# EAGLE design PCB_Agrosavia (EAGLE 9.6.2)
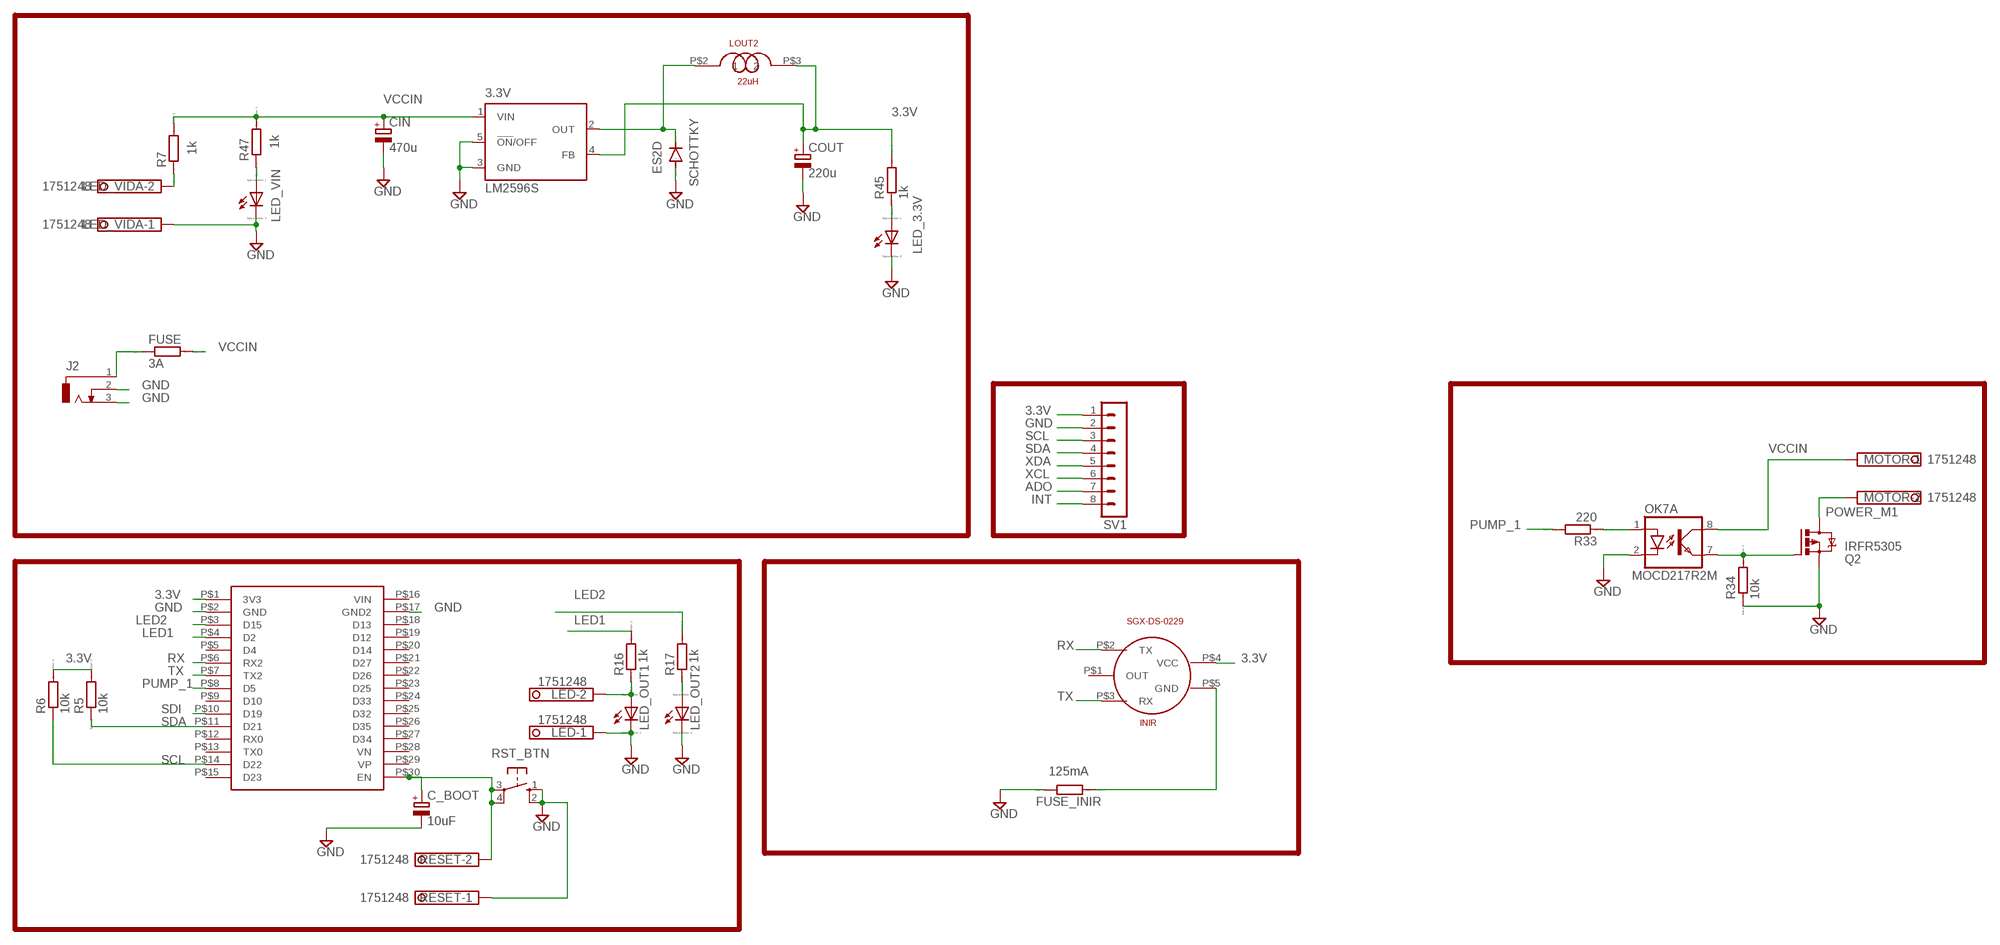
[diagram p0: schematic, sheet 1]

## Parts
3.3V  LM2596S  [TO263-5]
C_BOOT  10uF  CPOL-EUSANYO_SMD_B6  [SANYO-OSCON_SMD_B6]
CIN  470u  CPOL-EUSANYO_SMD_F12  [SANYO-OSCON_SMD_F12]
COUT  220u  CPOL-EUUD-10X10  [UD-10X10_NICHICON]
ESP32DEVKITV1  ESP32  [ESP32]
FUSE  3A  RR1206  [R1206]
FUSE_INIR  125mA  RR0402  [R0402]
J2  DCJ0303  [DCJ0303]
LED  1751248  [1751248]
LED_3.3V  LED_E  [LED_1206]
LED_OUT1  LED_E  [LED_1206]
LED_OUT2  LED_E  [LED_1206]
LED_VIDA  1751248  [1751248]
LED_VIN  LED_E  [LED_1206]
LOUT2  22uH  SRP1038A  [SRP1038A]
MOTOR  1751248  [1751248]
OK7  MOCD217R2M  ILD205  [SOIC08]
Q2  IRFR5305  [D-PAK_TO252AA]
R5  10k  RR1206  [R1206]
R6  10k  RR1206  [R1206]
R7  1k  R  [R0805]
R16  1k  R  [R0805]
R17  1k  R  [R0805]
R33  220  RR0603  [R0603]
R34  10k  RR1206  [R1206]
R45  1k  R  [R0805]
R47  1k  R  [R0805]
RESET  1751248  [1751248]
RST_BTN  10-XX  [B3F-10XX]
SCHOTTKY  ES2D  [SMB]
SGX-DS-0229  INIR  [INIR]
SV1  MA08-1  [MA08-1]

## Nets
3.3V: 3.3V.4(FB) COUT.+ ESP32DEVKITV1.P$1(3V3) LOUT2.P$3 R5.2 R6.2 R45.2 SGX-DS-0229.P$4(VCC) SV1.1
ADO: SV1.7
GND: 3.3V.3(GND) 3.3V.5(!ON!/OFF) C_BOOT.- CIN.- COUT.- ESP32DEVKITV1.P$2(GND) ESP32DEVKITV1.P$17(GND2) FUSE_INIR.2 J2.2 J2.3 LED.1 LED_3.3V.C LED_OUT1.C LED_OUT2.C LED_VIDA.1 LED_VIN.C OK7.2(A:C) Q2.3(S) R34.1 RESET.1 RST_BTN.1(S) RST_BTN.2(S1) SCHOTTKY.A SV1.2
INT: SV1.8
LED1: ESP32DEVKITV1.P$4(D2) R16.2
LED2: ESP32DEVKITV1.P$3(D15) R17.2
N$6: FUSE_INIR.1 SGX-DS-0229.P$5(GND)
N$7: C_BOOT.+ ESP32DEVKITV1.P$30(EN) RESET.2 RST_BTN.3(P) RST_BTN.4(P1)
N$9: LED_VIDA.2 R7.1
N$15: LED.2 LED_OUT1.A R16.1
N$16: LED_OUT2.A R17.1
N$33: OK7.1(A:A) R33.1
N$37: OK7.7(A:EMIT) Q2.1(G) R34.2
N$43: 3.3V.2(OUT) LOUT2.P$2 SCHOTTKY.C
N$48: LED_3.3V.A R45.1
N$49: LED_VIN.A R47.1
N$63: FUSE.1 J2.1
POWER_M1: MOTOR.2 Q2.4(D)
PUMP_1: ESP32DEVKITV1.P$8(D5) R33.2
RX: ESP32DEVKITV1.P$6(RX2) SGX-DS-0229.P$2(TX)
SCL: ESP32DEVKITV1.P$14(D22) R6.1 SV1.3
SDA: ESP32DEVKITV1.P$11(D21) R5.1 SV1.4
SDI: ESP32DEVKITV1.P$10(D19)
TX: ESP32DEVKITV1.P$7(TX2) SGX-DS-0229.P$3(RX)
VCCIN: 3.3V.1(VIN) CIN.+ FUSE.2 MOTOR.1 OK7.8(A:COL) R7.2 R47.2
XCL: SV1.6
XDA: SV1.5
Unconnected: ESP32DEVKITV1.P$5(D4) ESP32DEVKITV1.P$9(D10) ESP32DEVKITV1.P$12(RX0) ESP32DEVKITV1.P$13(TX0) ESP32DEVKITV1.P$15(D23) ESP32DEVKITV1.P$16(VIN) ESP32DEVKITV1.P$18(D13) ESP32DEVKITV1.P$19(D12) ESP32DEVKITV1.P$20(D14) ESP32DEVKITV1.P$21(D27) ESP32DEVKITV1.P$22(D26) ESP32DEVKITV1.P$23(D25) ESP32DEVKITV1.P$24(D33) ESP32DEVKITV1.P$25(D32) ESP32DEVKITV1.P$26(D35) ESP32DEVKITV1.P$27(D34) ESP32DEVKITV1.P$28(VN) ESP32DEVKITV1.P$29(VP) OK7.3(B:A) OK7.4(B:C) OK7.5(B:EMIT) OK7.6(B:COL) SGX-DS-0229.P$1(OUT)

## Library data of the parts
3.3V = national-semiconductor:LM2596: SIMPLE SWITCHER® Power Converter 150 kHz 3A Step-Down Voltage Regulator Source: http://www.national.com/ds/LM/LM2596.pdf; MF: NATIONAL SEMICONDUCTOR; MPN: LM2596S-ADJ/NOPB; OC_FARNELL: 9494367; OC_NEWARK: 41K3842
C_BOOT CIN COUT = rcl:CPOL-EU: POLARIZED CAPACITOR, European symbol; SPICEPREFIX: C
ESP32DEVKITV1 = ESP32:ESP32
FUSE FUSE_INIR R5-R7 R16 R17 R33 R34 R45 R47 = eagle-ltspice:R: RESISTOR, European symbol; SPICEMODEL: NONE; SPICEPREFIX: R
J2 = con-jack:DCJ0303: DC POWER JACK Source: DCJ0303.pdf; OC_FARNELL: unknown; OC_NEWARK: unknown
LED LED_VIDA MOTOR RESET = con-phoenix-350:1751248: MKDS 1/ 2-3,5 Printklemme Nennstrom: 10 A Bemessungsspannung: 160 V Raster: 3,5 mm Polzahl: 2 Montageart: Löten Anschlussart: Schraubanschluss Anschlussrichtung vom Leiter zur Platine: 0° Source: http://eshop.phoenixcontact.com .. 1751248.pdf; OC_FARNELL: unknown; OC_NEWARK: unknown
LED_3.3V LED_OUT1 LED_OUT2 LED_VIN = eagle-ltspice:LED_E: LED Source: http://www.osram.convergy.de Source: www.luxeon.com Source: www.kingbright.com; SPICEMODEL: NONE; SPICEPREFIX: D; SPICETYPE: diode
LOUT2 = SRP1038A:SRP1038A
OK7 = optocoupler:ILD2*: Siemens ILD205/206/207/211/213/217 DUAL PHOTOTRANSISTOR SMALL OUTLINE SURFACE MOUNT OPTOCOUPLER Source: 153385-da-01-en-Optocoupler_ILD205-T.pdf; MF: VISHAY/TELEFUNKEN; MPN: ILD205T; OC_FARNELL: 1469512; OC_NEWARK: 20H8678
Q2 = transistor-power:IRF?5305: HEXFET Power MOSFET Source: http://www.irf.com/product-info/datasheets/data/irfr5305pbf.pdf
RST_BTN = switch-omron:10-XX: OMRON SWITCH; MPN: B3F-1000; OC_FARNELL: 176432; OC_NEWARK: 36M3542
SCHOTTKY = diode:ES2D: DIODE super fast rectifier, 2 A
SGX-DS-0229 = INIR:INIR
SV1 = con-lstb:MA08-1: PIN HEADER; OC_FARNELL: unknown; OC_NEWARK: unknown

## Board
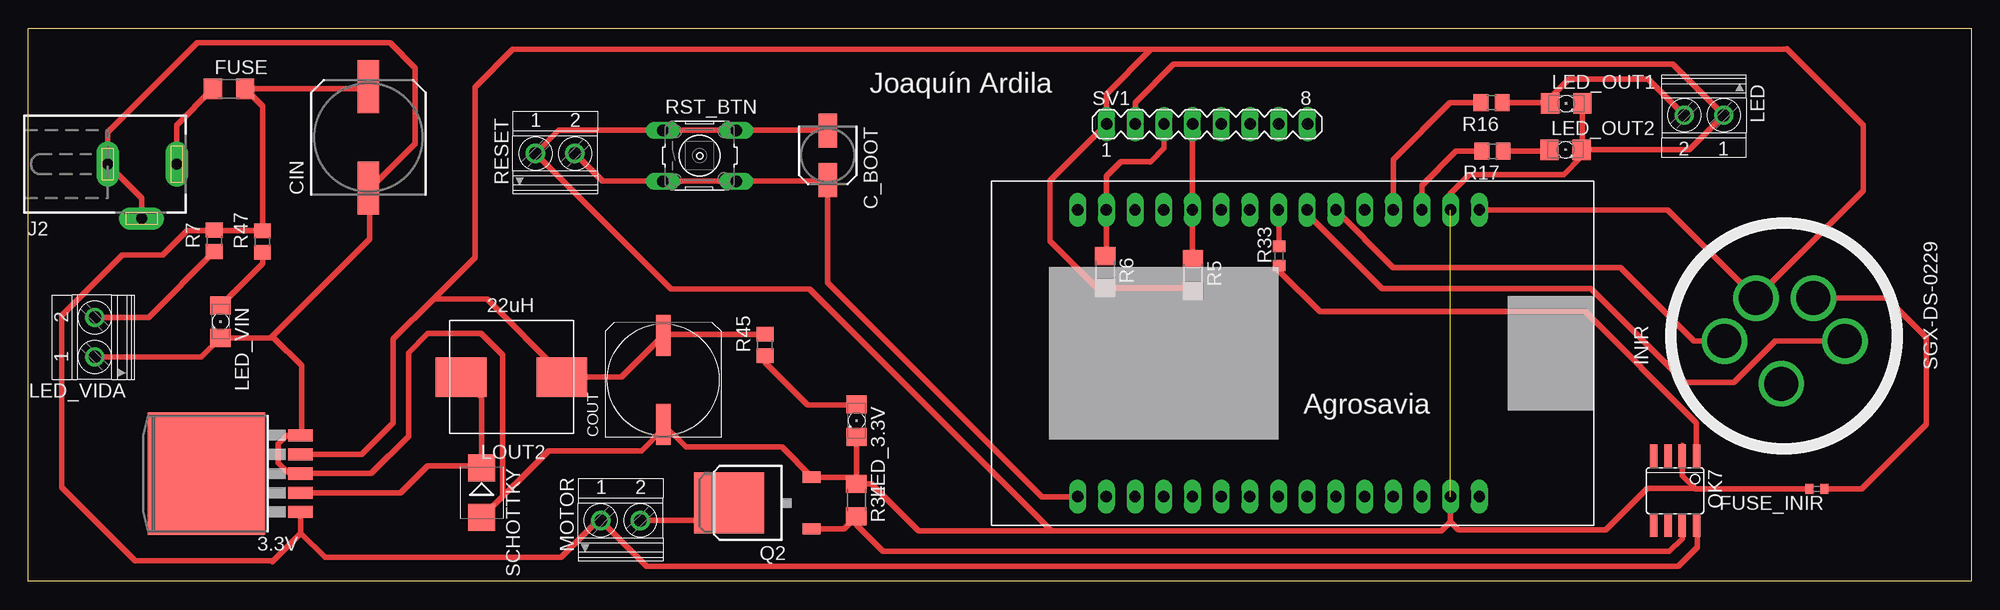
[diagram p1: board, top side]

Size 172 x 49 mm. Coordinates in mm from the lower left corner, seen from the top.
Outline: 0,49 172,49 172,0 0,0 0,49
Copper layers (1*16): Top 0.035mm / dielectric 1.5mm / Bottom 0.035mm
Design rules "default": minimum track width 6mil, minimum drill 0.35mm, track to track 6mil, track to pad 6mil, pad to pad 6mil, via to via 6mil, smd to smd 6mil, copper to edge 40mil, drill to drill 6mil, minimum pad ring 10mil, minimum via ring 8mil, stop-mask expansion 4mil, vias tented up to drill 0mil, thermal gap 10mil

### Footprints (pad centres in the part's own frame; a part is rotated, then mirrored left to right if it is on the bottom)
TO263-5 = smd 1.067 x 2.159: 1 -3.404,-5.791; 2 -1.702,-5.791; 3 0,-5.791; 4 1.702,-5.791; 5 3.404,-5.791 | smd 10.8 x 10.41: 6 0,2.54
SANYO-OSCON_SMD_B6 = smd 3 x 1.6: + 2.2,0; - -2.2,0
SANYO-OSCON_SMD_F12 = smd 4.7 x 1.9: + 4.5,0; - -4.5,0
UD-10X10_NICHICON = smd 3.6 x 1.3: + 3.925,0; - -3.95,0
ESP32 = drill 1 long: P$1 -12.7,15.24; P$2 -12.7,12.7; P$3 -12.7,10.16; P$4 -12.7,7.62; P$5 -12.7,5.08; P$6 -12.7,2.54; P$7 -12.7,0; P$8 -12.7,-2.54; P$9 -12.7,-5.08; P$10 -12.7,-7.62; P$11 -12.7,-10.16; P$12 -12.7,-12.7; P$13 -12.7,-15.24; P$14 -12.7,-17.78; P$15 -12.7,-20.32; P$16 12.7,15.24; P$17 12.7,12.7; P$18 12.7,10.16; P$19 12.7,7.62; P$20 12.7,5.08; P$21 12.7,2.54; P$22 12.7,0; P$23 12.7,-2.54; P$24 12.7,-5.08; P$25 12.7,-7.62; P$26 12.7,-10.16; P$27 12.7,-12.7; P$28 12.7,-15.24; P$29 12.7,-17.78; P$30 12.7,-20.32
R1206 = smd 1.6 x 1.803: 1 -1.422,0; 2 1.422,0
R0402 = smd 0.7 x 0.9: 1 -0.65,0; 2 0.65,0
DCJ0303 = drill 1 pad 2 long: 1 0,3.1; 2 4.8,0; 3 0,-3
1751248 = drill 1.1 pad 1.7: 1 -1.75,-0.1; 2 1.75,-0.1
LED_1206 = smd 1.6 x 1.803: A -1.422,0; C 1.422,0
SRP1038A = smd 4.5 x 3.5: P$2 4.45,0; P$3 -4.45,0
SOIC08 = smd 0.66 x 2.032: 1 -1.905,-3.073; 2 -0.635,-3.073; 3 0.635,-3.073; 4 1.905,-3.073; 5 1.905,3.073; 6 0.635,3.073; 7 -0.635,3.073; 8 -1.905,3.073
D-PAK_TO252AA = smd 1 x 1.6: 1 -2.28,-4.8; 3 2.28,-4.8 | smd 5.4 x 6.2: 4 0,2.5
R0805 = smd 1.3 x 1.5: 1 -0.95,0; 2 0.95,0
R0603 = smd 1 x 1.1: 1 -0.85,0; 2 0.85,0
B3F-10XX = drill 1.016 long: 1 -3.251,2.261; 2 3.251,2.261; 3 -3.251,-2.261; 4 3.251,-2.261
SMB = smd 2.4 x 2.4: A 2.2,0; C -2.2,0
INIR = drill 3 pad 4: P$1 4.24,0.254; P$2 0.46,5.289; P$3 0.46,-5.381; P$4 -3.34,2.494; P$5 -3.34,-2.586
MA08-1 = drill 1.016 long: 1 -8.89,0; 2 -6.35,0; 3 -3.81,0; 4 -1.27,0; 5 1.27,0; 6 3.81,0; 7 6.35,0; 8 8.89,0

### Placement (x,y rotation side)
3.3V  18.3,9.55 90 top
C_BOOT  70.78,37.74 270 top
CIN  30.11,39.33 90 top
COUT  56.21,17.86 90 top
ESP32DEVKITV1  113.21,20.21 270 top
FUSE  17.77,43.63 0 top
FUSE_INIR  158.32,8.21 180 top
J2  10.04,36.96 270 top
LED  148.34,41.19 180 top
LED_3.3V  73.32,14.24 270 top
LED_OUT1  136.14,42.33 0 top
LED_OUT2  136.08,38.24 0 top
LED_VIDA  5.79,21.64 90 top
LED_VIN  17.02,23.01 270 top
LOUT2  42.79,18.09 180 top
MOTOR  52.43,5.5 0 top
OK7  145.78,8.04 180 top
Q2  64.53,6.95 90 top
R5  103.1,27.14 270 top
R6  95.33,27.4 270 top
R7  16.48,30.17 90 top
R16  129.53,42.41 180 top
R17  129.62,38.1 180 top
R33  110.72,28.83 90 top
R34  73.32,7.21 270 top
R45  65.21,20.94 90 top
R47  20.73,30.11 90 top
RESET  46.65,38.01 0 top
RST_BTN  59.43,37.71 0 top
SCHOTTKY  40.13,7.87 270 top
SGX-DS-0229  155.44,21.75 270 bottom
SV1  104.35,40.51 0 top

### Tracks (layer width: path | path; a pad name or v marks a point on that pad's centre or on a via)
3.3V
  Top 0.5: 3.3V.4 29.52,11.25 32.32,14.05 32.32,21.46 35.87,25.01 | 35.87,25.01 40.61,25.01 47.24,18.38 LOUT2.P$3 52.52,18.09 COUT.+ 56.31,21.89 R45.2 65.29,21.97 | 155.73,47.13 162.46,40.39 162.46,34.61 SGX-DS-0229.P$4 145.12,32.91 ESP32DEVKITV1.P$1 | 155.73,47.13 155.66,47.19 | R5.2 102.85,25.98 R6.2 94.62,25.98 90.46,30.14 90.46,35.51 SV1.1 95.46,43.18 99.41,47.13 | 155.73,47.13 99.41,47.13 | 99.41,47.13 42.88,47.13 39.55,43.8 39.55,28.69 35.87,25.01
GND  (1 unrouted)
  Top 0.5: C_BOOT.- 70.74,39.97 RST_BTN.2 RST_BTN.1 46.96,39.97 RESET.1 56.9,25.91 69.16,25.91 90.6,4.47 | 73.17,8.48 R34.1 | J2.2 10.04,33.96 J2.3 7.04,39.77 14.96,47.7 32.02,47.7 34.26,45.46 34.26,38.8 30.29,34.83 CIN.- 30.21,34.73 30.21,30.34 21.45,21.58 LED_VIN.C | LED_VIDA.1 15.32,19.89 LED_VIN.C | Q2.3 69.39,9.23 | 69.39,9.23 72.72,9.23 R34.1 | 69.39,9.23 66.72,11.9 58.22,11.9 COUT.- 56.21,13.52 54.27,11.58 46.05,11.58 SCHOTTKY.A 42,7.54 42,20.06 40.1,21.96 35.36,21.96 33.65,20.25 33.65,12.85 30.36,9.55 3.3V.3 23.08,9.55 22.14,10.49 22.14,12.17 22.92,12.96 3.3V.5 24.2,13.06 24.2,19.12 21.73,21.58 LED_VIN.C | LED_OUT1.C 137.56,38.29 LED_OUT2.C | ESP32DEVKITV1.P$2 125.91,34.37 127.58,36.04 135.92,36.04 137.51,37.62 LED_OUT2.C | LED_OUT2.C 147.04,38.24 LED.1 145.57,45.81 101.39,45.81 98,42.42 SV1.2 | LED_3.3V.C R34.1 | 146.41,12.06 OK7.2 146.41,9.37 147.55,8.23 | FUSE_INIR.2 147.58,8.21 147.55,8.23 | 147.55,8.23 143.34,8.23 139.67,4.57 126.61,4.57 125.91,5.26 125.91,5.27 | ESP32DEVKITV1.P$17 125.91,5.27 | R34.1 74.67,8.63 78.83,4.47 90.6,4.47 | 90.6,4.47 125.11,4.47 125.91,5.27
LED1
  Top 0.5: ESP32DEVKITV1.P$4 120.83,37.37 125.87,42.41 R16.2
LED2
  Top 0.5: ESP32DEVKITV1.P$3 123.37,35.08 126.39,38.1 R17.2
N$6
  Top 0.5: SGX-DS-0229.P$5 164.51,25.09 168,21.59 | 168,21.59 168.03,21.57 | 168,21.59 168,13.92 162.29,8.21 FUSE_INIR.1
N$7
  Top 0.5: RESET.2 50.86,35.45 RST_BTN.3 RST_BTN.4 70.69,35.45 C_BOOT.+ 70.78,26.47 89.73,7.51 ESP32DEVKITV1.P$30
N$9
  Top 0.5: LED_VIDA.2 10.65,23.39 R7.1
N$15
  Top 0.5: R16.1 134.64,42.41 LED_OUT1.A 134.72,42.81 136.39,44.48 143.4,44.48 LED.2
N$16
  Top 0.5: R17.1 134.52,38.1 LED_OUT2.A
N$33
  Top 0.5: OK7.1 147.68,14.03 137.82,23.89 114.33,23.89 110.72,27.5 R33.1
N$37
  Top 0.5: Q2.1 72.2,4.67 R34.2 73.32,5.02 75.69,2.65 145.29,2.65 146.41,3.78 OK7.7
N$43
  Top 0.5: SCHOTTKY.C 40.13,10.25 | 40.13,10.25 40.13,16.3 LOUT2.P$2 | 3.3V.2 32.95,7.85 35.35,10.25 40.13,10.25
N$48
  Top 0.5: R45.1 65.21,19.4 68.98,15.63 73.29,15.63 LED_3.3V.A
N$49
  Top 0.5: LED_VIN.A 20.73,28.14 R47.1
N$63
  Top 0.5: J2.1 13.14,40.42 FUSE.1
POWER_M1
  Top 0.5: MOTOR.2 61.57,5.4 62.03,5.86 Q2.4
PUMP_1
  Top 0.5: ESP32DEVKITV1.P$8 110.72,32.86 R33.2
RX
  Top 0.5: SGX-DS-0229.P$2 147.46,21.29 140.93,27.82 120.82,27.82 115.75,32.89 ESP32DEVKITV1.P$6
SCL
  Top 0.5: R6.1 95.43,28.92 ESP32DEVKITV1.P$14 95.43,35.9 96.72,37.19 99.37,37.19 | SV1.3 100.54,38.36 99.37,37.19 | 99.37,37.19 99.31,37.14
SDA
  Top 0.5: SV1.4 103.08,32.94 ESP32DEVKITV1.P$11 103.05,28.62 R5.1
TX
  Top 0.5: SGX-DS-0229.P$3 154.65,21.29 151,17.64 146.64,17.64 138.31,25.96 119.84,25.96 113.21,32.59 ESP32DEVKITV1.P$7
VCCIN
  Top 0.5: CIN.+ 29.91,43.63 FUSE.2 20.73,42.09 R47.2 16.54,31.06 | 16.54,31.06 R7.2 | 3.3V.1 24.1,4.3 24.12,4.28 | 24.12,4.28 26.27,2.13 47.16,2.13 50.44,5.4 MOTOR.1 54.73,1.36 146.07,1.36 147.74,3.03 147.74,4.91 OK7.8 | 21.59,1.75 21.69,1.85 | 21.69,1.85 24.12,4.28 | 21.69,1.85 9.47,1.85 2.96,8.36 2.96,23.55 8.31,28.9 11.92,28.9 14.08,31.06 16.54,31.06

### Text on the board
tNames: Joaquín Ardila | Agrosavia